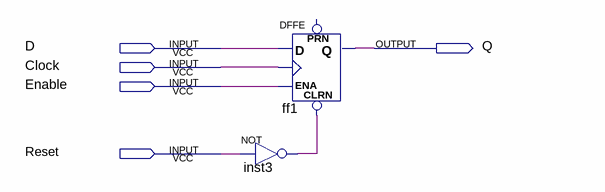
[diagram p0: schematic sheet]
// Quartus schematic register1.bdf as structural Verilog: 2 symbols, 5 pins
module register1 (
  input  D,
  input  Clock,
  input  Enable,
  input  Reset,
  output Q
);

  wire inst3_out;

  not inst3 (inst3_out, Reset);
  DFFE ff1 (.CLRN(inst3_out), .D(D), .CLK(Clock), .ENA(Enable), .Q(Q));  // open: PRN
endmodule
